# EAGLE board Singularitron 1B (EAGLE 7.7.0)
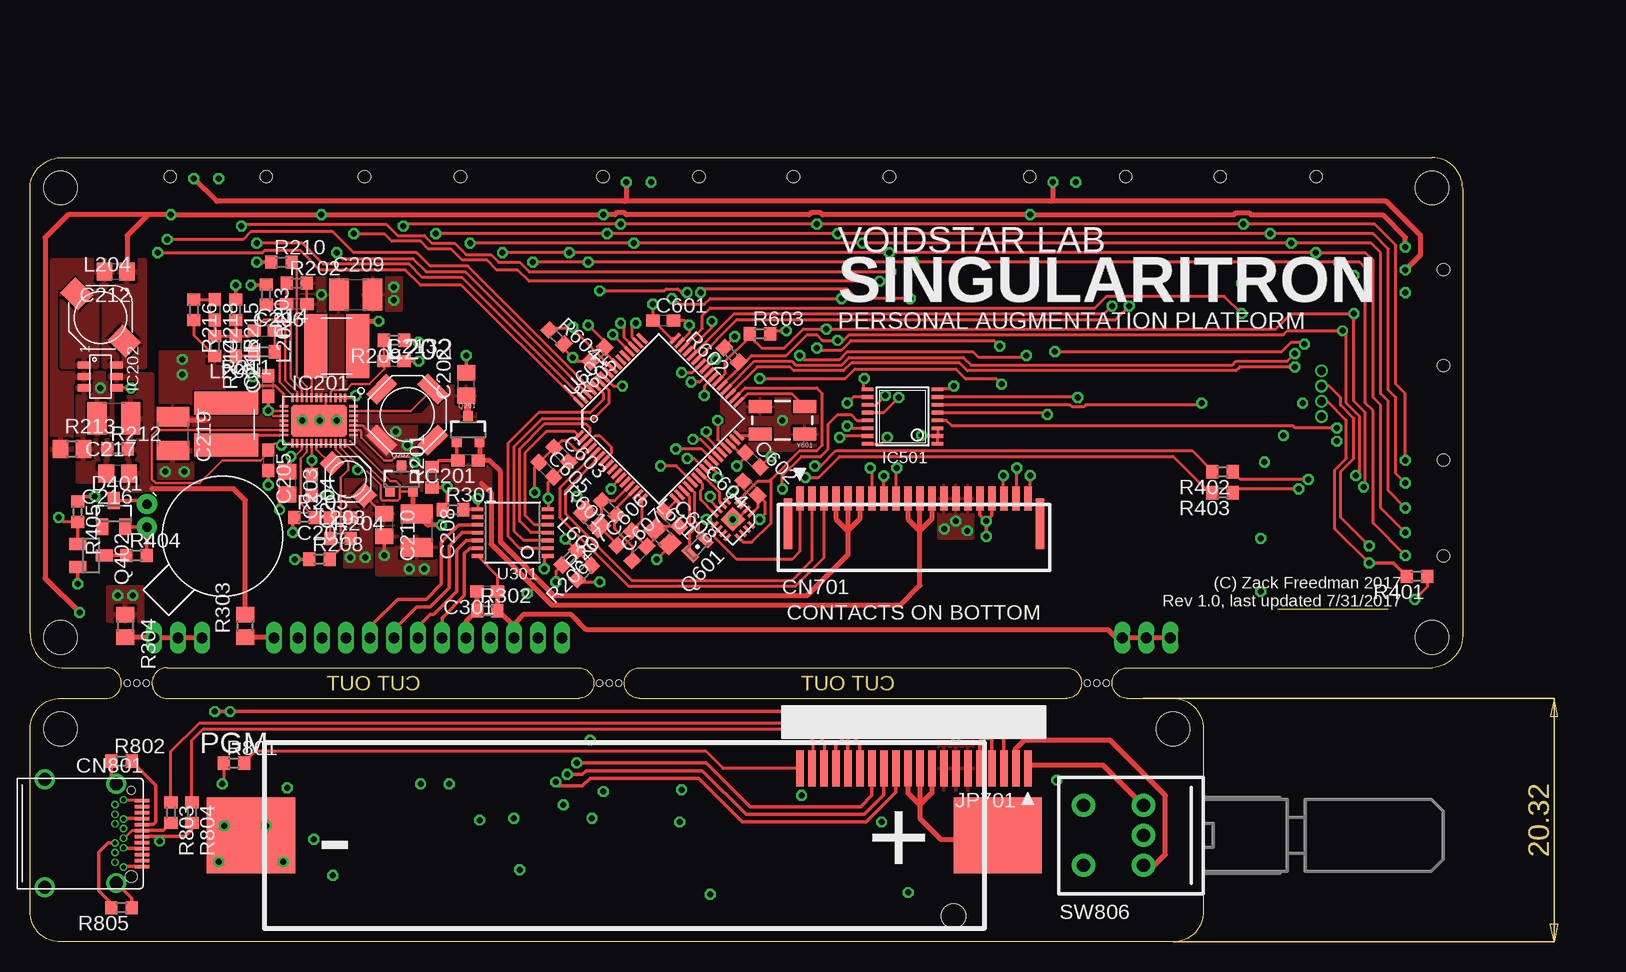
[diagram p8: board, top side]
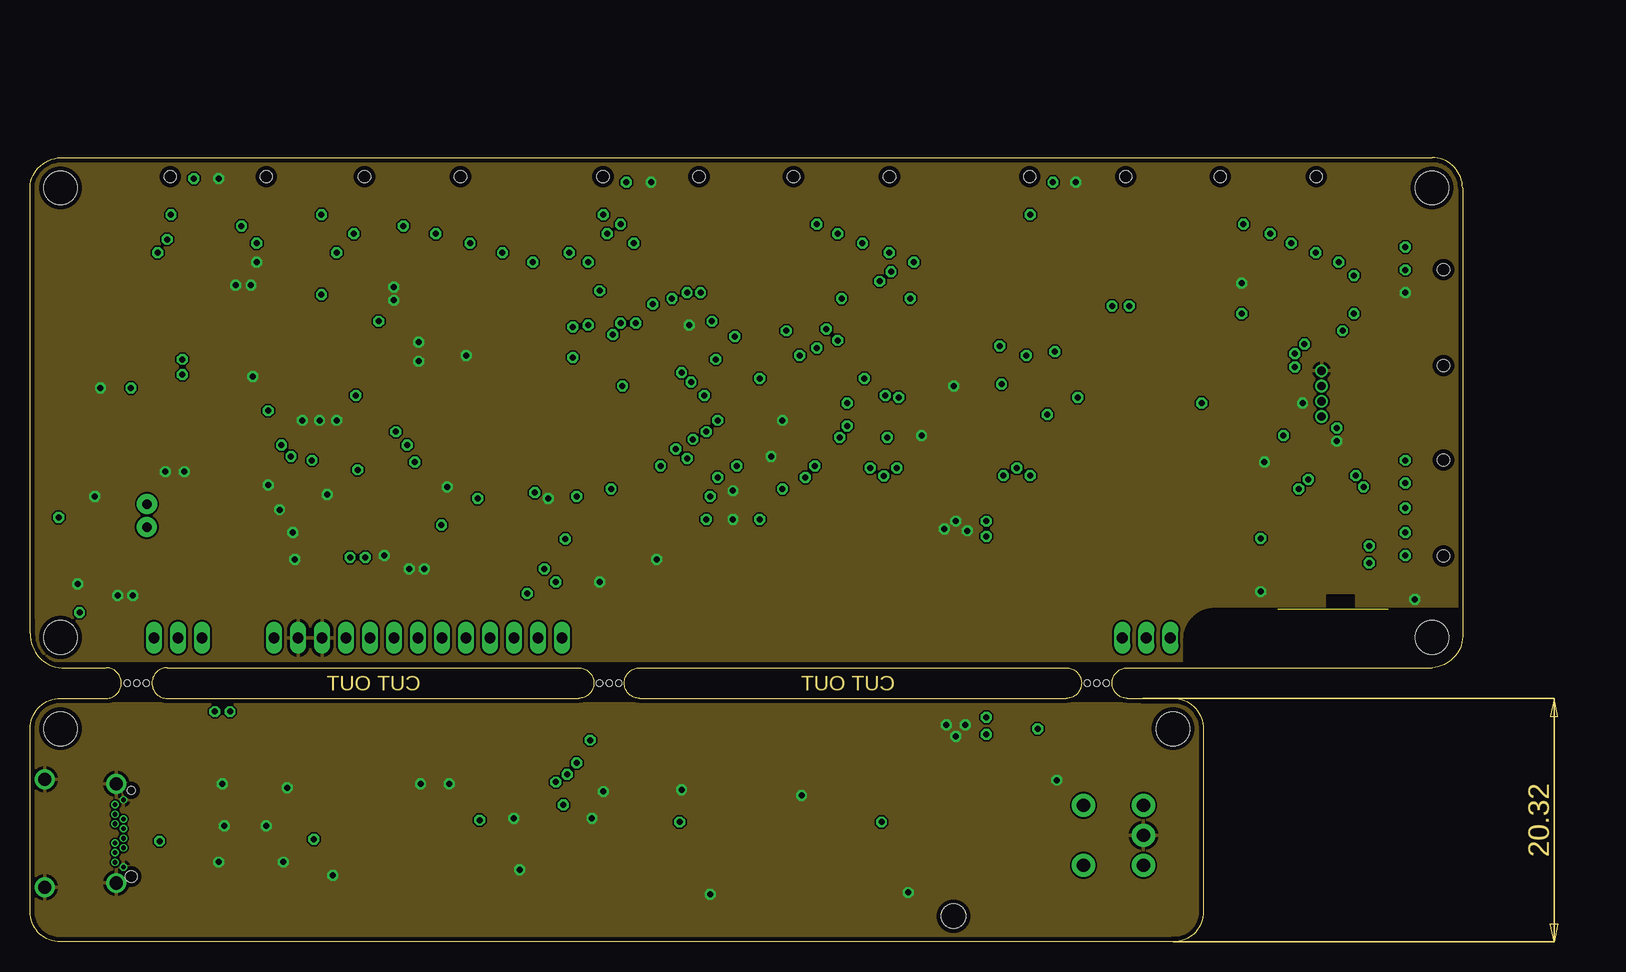
[diagram p9: board, inner layer Route2]
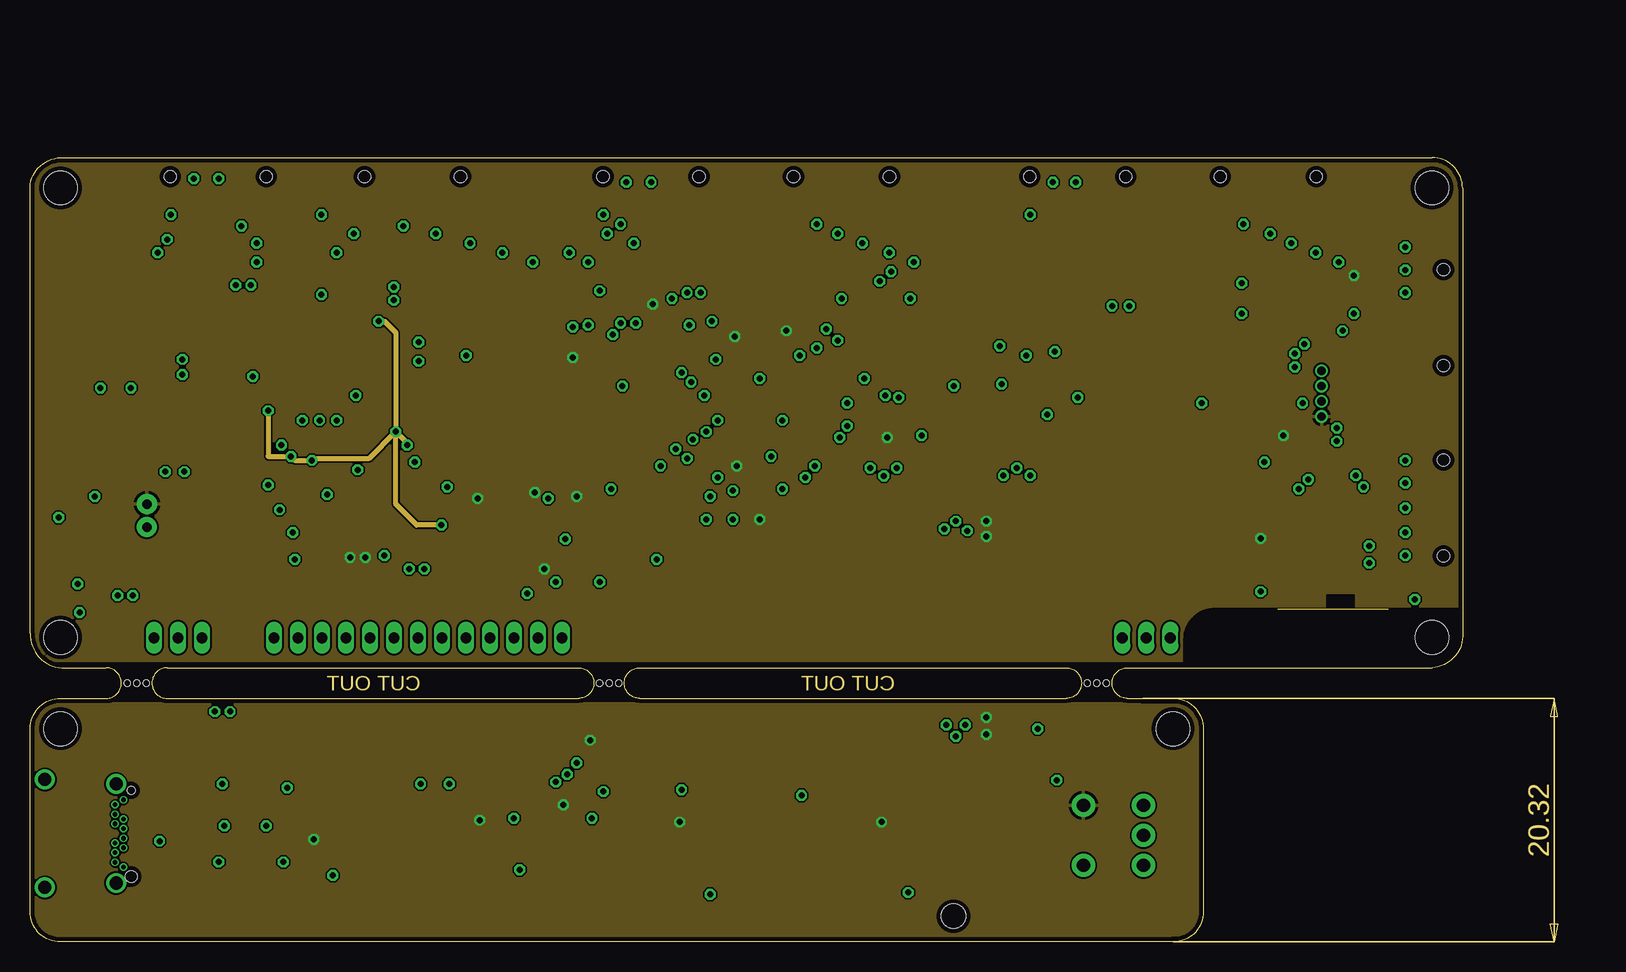
[diagram p10: board, inner layer Route15]
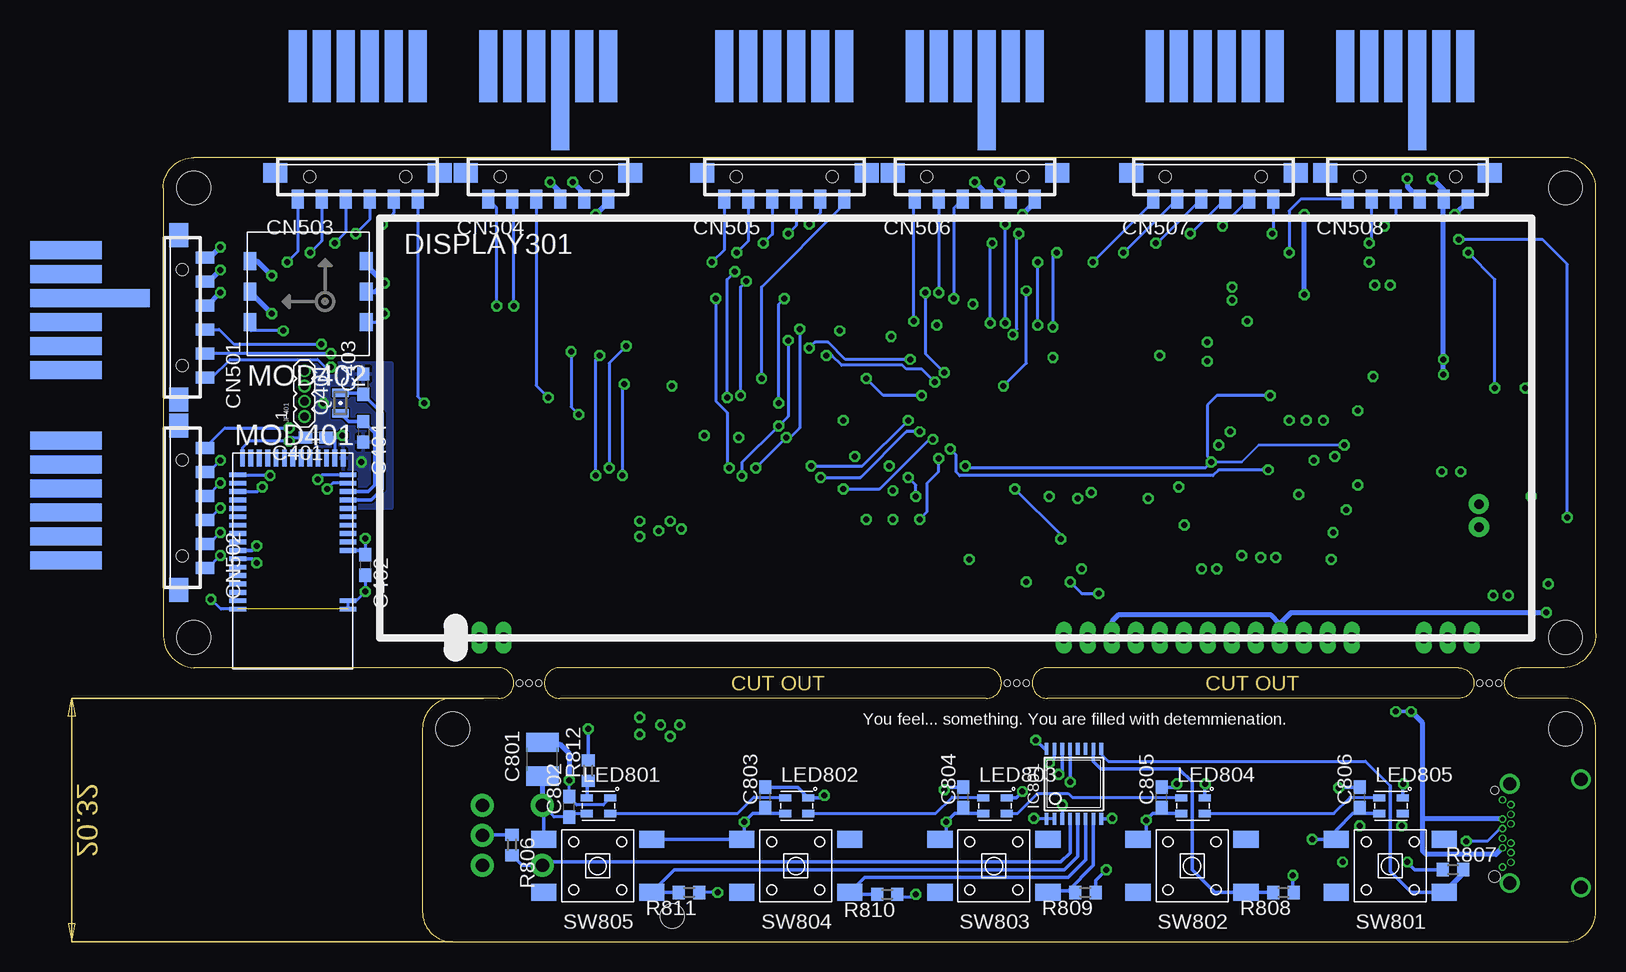
[diagram p11: board, bottom side, seen from below]

Size 119.38 x 65.41 mm. Coordinates in mm from the lower left corner, seen from the top.
Outline: 119.38,62.87 119.38,25.72 arc-90 116.84,22.86 91.44,22.86 arc90 90.17,21.59 arc90 91.44,20.32 95.25,20.32 arc-90 97.79,17.78 97.79,2.54 arc-90 95.25,0 2.54,0 arc-90 0,2.54 0,17.78 arc-90 2.54,20.32 6.35,20.32 arc90 7.62,21.59 arc90 6.35,22.86 3.17,22.86 arc-98 0,25.72 0,63.18 arc-76 2.54,65.41 116.84,65.41 arc-90 119.38,62.87
Outline: 11.43,22.86 45.72,22.86 arc-90 46.99,21.59 arc-90 45.72,20.32 11.43,20.32 arc-90 10.16,21.59 arc-90 11.43,22.86
Outline: 50.8,22.86 86.36,22.86 arc-90 87.63,21.59 arc-90 86.36,20.32 50.8,20.32 arc-90 49.53,21.59 arc-90 50.8,22.86
Copper layers (1*2*15*16): Top 0.035559375mm / dielectric 1.501140625mm / Route2 0.035559375mm / dielectric 0.149859375mm / Route15 0.035559375mm / dielectric 0.200659375mm / Bottom 0.035559375mm
Design rules "typical_4pcb *": minimum track width 7mil, minimum drill 15mil, track to track 6mil, track to pad 6mil, pad to pad 6mil, via to via 6mil, smd to smd 6mil, copper to edge 15mil, drill to drill 8mil, minimum pad ring 4mil, minimum via ring 8mil, stop-mask expansion 2mil, vias tented up to drill 24mil, thermal gap 10mil
Holes 2.8 mm at 116.84,25.4 116.84,62.87 2.54,25.4 2.54,62.87 2.54,17.78 95.25,17.78
Holes 0.5 mm at 89.69,21.59 88.11,21.59 88.9,21.59 8.89,21.59 9.68,21.59 8.1,21.59 48.26,21.59 49.05,21.59 47.47,21.59

## Footprints (pad centres in the part's own frame; a part is rotated, then mirrored left to right if it is on the bottom)
KEYSTONE-1024-PROVISIONAL = smd 7.366 x 6.35: + -31.115,0; - 31.115,0 | hole 2: -27.432,6.731
C0603 = smd 1.1 x 1: 1 -0.85,0; 2 0.85,0
C0805 = smd 1.3 x 1.5: 1 -0.95,0; 2 0.95,0
C1210 = smd 1.6 x 2.7: 1 -1.4,0; 2 1.4,0
9155006 = smd 2 x 1.6: NAIL1 -6.85,0.3; NAIL2 6.85,0.3 | smd 1 x 1.55: PAD1 5,-1.88; PAD2 3,-1.88; PAD3 1,-1.88; PAD4 -1,-1.88; PAD5 -3,-1.88; PAD6 -5,-1.88 | hole 1: -4,0; 4,0
HFW20R-1STE1LF = smd 0.7 x 4.2: NAIL1 -10.5,0.44; NAIL2 10.5,0.44 | smd 0.6 x 2: P$1 -9.5,2.54; P$2 -8.5,2.54; P$3 -7.5,2.54; P$4 -6.5,2.54; P$5 -5.5,2.54; P$6 -4.5,2.54; P$7 -3.5,2.54; P$8 -2.5,2.54; P$9 -1.5,2.54; P$10 -0.5,2.54; P$11 0.5,2.54; P$12 1.5,2.54; P$13 2.5,2.54; P$14 3.5,2.54; P$15 4.5,2.54; P$16 5.5,2.54; P$17 6.5,2.54; P$18 7.5,2.54; P$19 8.5,2.54; P$20 9.5,2.54
12401548E4#2A = smd 0.3 x 1.2: A1 -2.75,4.9; A2 -2.25,4.9; A3 -1.75,4.9; A4 -1.25,4.9; A5 -0.75,4.9; A6 -0.25,4.9; A7 0.25,4.9; A8 0.75,4.9; A9 1.25,4.9; A10 1.75,4.9; A11 2.25,4.9; A12 2.75,4.9 | drill 0.4 pad 0.61: B1 2.8,3.34; B2 2.4,2.64; B3 1.6,2.64; B4 1.2,3.34; B5 0.8,2.64; B6 0.4,3.34; B7 -0.4,3.34; B8 -0.8,2.64; B9 -1.2,3.34; B10 -1.6,2.64; B11 -2.4,2.64; B12 -2.8,3.34 | drill 1.1 pad 1.4: SHIELD1 -4.13,2.74; SHIELD2 4.13,2.74; SHIELD3 -4.5,-3.21; SHIELD4 4.5,-3.21 | hole 0.65: -3.6,3.99 | hole 0.95: 3.6,3.99
SOT23 = smd 1 x 1.4: 1 -0.95,-1.1; 2 0.95,-1.1; 3 0,1.1
DS2045 = drill 0.9 long: 1 -41.682,-17.5; 2 -39.682,-17.5; 3 -37.682,-17.5; 26 9,-17.5; 27 11,-17.5; 28 13,-17.5; 29 15,-17.5; 30 17,-17.5; 31 19,-17.5; 32 21,-17.5; 33 23,-17.5; 34 25,-17.5; 35 27,-17.5; 36 29,-17.5; 37 31,-17.5; 38 33,-17.5; 41 39,-17.5; 42 41,-17.5; 43 43,-17.5
QFN-38_EP_UFE = smd 4.65 x 2.65: EP 0,0 | smd 0.2 x 0.7: P$1 -2.2,-1.9; P$2 -1.8,-1.9; P$3 -1.4,-1.9; P$4 -1,-1.9; P$5 -0.6,-1.9; P$6 -0.2,-1.9; P$7 0.2,-1.9; P$8 0.6,-1.9; P$9 1,-1.9; P$10 1.4,-1.9; P$11 1.8,-1.9; P$12 2.2,-1.9; P$20 2.2,1.9; P$21 1.8,1.9; P$22 1.4,1.9; P$23 1,1.9; P$24 0.6,1.9; P$25 0.2,1.9; P$26 -0.2,1.9; P$27 -0.6,1.9; P$28 -1,1.9; P$29 -1.4,1.9; P$30 -1.8,1.9; P$31 -2.2,1.9 | smd 0.7 x 0.2: P$13 2.9,-1.2; P$14 2.9,-0.8; P$15 2.9,-0.4; P$16 2.9,0; P$17 2.9,0.4; P$18 2.9,0.8; P$19 2.9,1.2; P$32 -2.9,1.2; P$33 -2.9,0.8; P$34 -2.9,0.4; P$35 -2.9,0; P$36 -2.9,-0.4; P$37 -2.9,-0.8; P$38 -2.9,-1.2
SOT-23 = smd 0.6 x 1.05: P1 -0.95,-1.35; P2 0,-1.35; P3 0.95,-1.35; P4 0.95,1.35; P5 0,1.35; P6 -0.95,1.35
TSSOP16 = smd 0.305 x 0.991: 1 -2.275,-2.918; 2 -1.625,-2.918; 3 -0.975,-2.918; 4 -0.325,-2.918; 5 0.325,-2.918; 6 0.975,-2.918; 7 1.625,-2.918; 8 2.275,-2.918; 9 2.275,2.918; 10 1.625,2.918; 11 0.975,2.918; 12 0.325,2.918; 13 -0.325,2.918; 14 -0.975,2.918; 15 -1.625,2.918; 16 -2.275,2.918
QFN16-3X3 = smd 0.7 x 0.25: 1 -1.4,0.75; 2 -1.4,0.25; 3 -1.4,-0.25; 4 -1.4,-0.75; 9 1.4,-0.75; 10 1.4,-0.25; 11 1.4,0.25; 12 1.4,0.75 | smd 0.25 x 0.7: 5 -0.75,-1.4; 6 -0.25,-1.4; 7 0.25,-1.4; 8 0.75,-1.4; 13 0.75,1.4; 14 0.25,1.4; 15 -0.25,1.4; 16 -0.75,1.4 | smd 1.45 x 1.45: PAD 0,0
1X04-1.27MM = drill 0.7 pad 1: 1 0,0; 2 1.27,0; 3 2.54,0; 4 3.81,0
SINGULARITRON_CART_BASE = smd 1.5 x 6 bottom: 3V3 -10.938,7; 5V -12.938,7; DETECT -6.938,7; GPIO1 -4.938,7; GPIO2 -2.938,7; MISO 6.938,7; MOSI 4.938,7; SCK 8.938,7; SCL 12.938,7; SDA 10.938,7; SS 2.938,7 | smd 1.5 x 10 bottom: GND -8.938,5
FFC_1MM_20POS_DIRECT = smd 0.6 x 3: P$1 -9.5,-0.5; P$2 -8.5,-0.5; P$3 -7.5,-0.5; P$4 -6.5,-0.5; P$5 -5.5,-0.5; P$6 -4.5,-0.5; P$7 -3.5,-0.5; P$8 -2.5,-0.5; P$9 -1.5,-0.5; P$10 -0.5,-0.5; P$11 0.5,-0.5; P$12 1.5,-0.5; P$13 2.5,-0.5; P$14 3.5,-0.5; P$15 4.5,-0.5; P$16 5.5,-0.5; P$17 6.5,-0.5; P$18 7.5,-0.5; P$19 8.5,-0.5; P$20 9.5,-0.5
CDRH4D22/HP = smd 5.3 x 1.9: P$1 0,1.75; P$2 0,-1.75
CDRH6D12 = smd 1.25 x 2.4 rotated 225: P$1 -2.139,-2.139 | smd 1.25 x 2.4 rotated 315: P$2 -2.139,2.139 | smd 1.25 x 2.4 rotated 45: P$3 2.139,2.139 | smd 1.25 x 2.4 rotated 135: P$4 2.139,-2.139
CDRH3D16/HP = smd 1.4 x 1.5 rotated 315: P$1 -1.343,1.343; P$2 1.343,-1.343
CDPH4D19F = smd 2.1 x 1.8 rotated 315: P$1 -1.98,1.98; P$2 1.98,-1.98
FB603 = smd 1.3 x 1.5: 1 -0.85,0; 2 0.85,0
SK6805-2427 = smd 1 x 0.6: DIN 0.375,1.85; DOUT 2.325,0.55; GND 2.325,1.85; VCC 0.375,0.55
MDBT40 = smd 1.4 x 0.4: P$1 -4.6,4; P$2 -4.6,3.3; P$3 -4.6,-0.9; P$4 -4.6,-1.6; P$5 -4.6,-2.3; P$6 -4.6,-3; P$7 -4.6,-3.7; P$8 -4.6,-4.4; P$9 -4.6,-5.1; P$10 -4.6,-5.8; P$11 -4.6,-6.5; P$12 -4.6,-7.2; P$26 4.6,-7.2; P$27 4.6,-6.5; P$28 4.6,-5.8; P$29 4.6,-5.1; P$30 4.6,-4.4; P$31 4.6,-3.7; P$32 4.6,-3; P$33 4.6,-2.3; P$34 4.6,-1.6; P$35 4.6,-0.9; P$36 4.6,-0.2; P$37 4.6,0.5; P$38 4.6,1.2; P$39 4.6,1.9; P$40 4.6,2.6; P$41 4.6,3.3; P$42 4.6,4 | smd 0.4 x 1.4: P$13 -4.2,-8.6; P$14 -3.5,-8.6; P$15 -2.8,-8.6; P$16 -2.1,-8.6; P$17 -1.4,-8.6; P$18 -0.7,-8.6; P$19 0,-8.6; P$20 0.7,-8.6; P$21 1.4,-8.6; P$22 2.1,-8.6; P$23 2.8,-8.6; P$24 3.5,-8.6; P$25 4.2,-8.6
EM7180SFP = smd 1.05 x 1.52: P$1 -4.845,2.79; P$2 -4.845,0.25; P$3 -4.845,-2.29; P$4 4.845,-2.29; P$5 4.845,0.25; P$6 4.845,2.79
VIBE-MOTOR-10MM = drill 0.8 pad 1.676: + -5,-3.9; - -6.35,-2.54
SOT23-3 = smd 0.8 x 0.9: 1 -0.95,-1; 2 0.95,-1; 3 0,1.1
FC-12M = smd 0.7 x 1.4: 1 -0.85,0; 2 0.85,0
R0603 = smd 1 x 1.1: 1 -0.85,0; 2 0.85,0
R0805 = smd 1.3 x 1.5: 1 -0.95,0; 2 0.95,0
TL3301-X-FXXX-X-G = smd 2.1 x 1.4: P$1 -4.5,2.2; P$2 4.5,2.2; P$3 -4.5,-2.2; P$4 4.5,-2.2
PEC09-2X20X-TXXXX = drill 1.1 pad 1.93: A -5,-2.5; B -5,2.5; C -5,0; D -10,-2.5; E -10,2.5
TSSOP14 = smd 0.305 x 0.991: 1 -1.95,-2.918; 2 -1.3,-2.918; 3 -0.65,-2.918; 4 0,-2.918; 5 0.65,-2.918; 6 1.3,-2.918; 7 1.95,-2.918; 8 1.95,2.918; 9 1.3,2.918; 10 0.65,2.918; 11 0,2.918; 12 -0.65,2.918; 13 -1.3,2.918; 14 -1.95,2.918
MK20DX128VLH5 = smd 1.1 x 0.285: 1 -5.605,3.385; 2 -5.605,2.885; 3 -5.605,2.385; 4 -5.605,1.885; 5 -5.605,1.385; 6 -5.605,0.885; 7 -5.605,0.385; 8 -5.605,-0.115; 9 -5.605,-0.615; 10 -5.605,-1.115; 11 -5.605,-1.615; 12 -5.605,-2.115; 13 -5.605,-2.615; 14 -5.605,-3.115; 15 -5.605,-3.615; 16 -5.605,-4.115; 33 5.795,-4.115; 34 5.795,-3.615; 35 5.795,-3.115; 36 5.795,-2.615; 37 5.795,-2.115; 38 5.795,-1.615; 39 5.795,-1.115; 40 5.795,-0.615; 41 5.795,-0.115; 42 5.795,0.385; 43 5.795,0.885; 44 5.795,1.385; 45 5.795,1.885; 46 5.795,2.385; 47 5.795,2.885; 48 5.795,3.385 | smd 0.285 x 1.1: 17 -3.655,-6.065; 18 -3.155,-6.065; 19 -2.655,-6.065; 20 -2.155,-6.065; 21 -1.655,-6.065; 22 -1.155,-6.065; 23 -0.655,-6.065; 24 -0.155,-6.065; 25 0.345,-6.065; 26 0.845,-6.065; 27 1.345,-6.065; 28 1.845,-6.065; 29 2.345,-6.065; 30 2.845,-6.065; 31 3.345,-6.065; 32 3.845,-6.065; 49 3.845,5.335; 50 3.345,5.335; 51 2.845,5.335; 52 2.345,5.335; 53 1.845,5.335; 54 1.345,5.335; 55 0.845,5.335; 56 0.345,5.335; 57 -0.155,5.335; 58 -0.655,5.335; 59 -1.155,5.335; 60 -1.655,5.335; 61 -2.155,5.335; 62 -2.655,5.335; 63 -3.155,5.335; 64 -3.655,5.335
CRYSTAL-SMD-5X3 = smd 1.9 x 1.1: 1 -1.85,-1.15; 2 1.85,-1.15; 3 1.85,1.15; 4 -1.85,1.15

## Placement (x,y rotation side)
BAT801  KEYSTONE_1024  [KEYSTONE-1024-PROVISIONAL]  49.53,8.89 180 top
C201  0.1µF  [C0603]  36.51,40.16 180 top
C202  10µF 16V  [C0805]  36.35,46.51 90 top
C203  10µF  [C0805]  21.43,38.26 270 top
C204  1µF  [C0603]  23.5,38.1 270 top
C205  1µF  [C0603]  19.84,40.16 270 top
C206  10pF  [C0603]  22.23,53.18 180 top
C207  10pF  [C0603]  25.88,35.4 180 top
C208  22µF  [C1210]  32.23,34.29 270 top
C209  22µH  [C1210]  27.15,53.97 0 top
C210  10µF  [C0805]  29.53,34.77 270 top
C211  2.2µF  [C0603]  19.84,46.36 90 top
C212  1µF  [C0805]  7.14,55.88 180 top
C213  0.1µF  [C0603]  30.32,48.42 0 top
C214  10pF  [C0603]  19.53,50.96 0 top
C215  330pF  [C0603]  17.14,49.69 270 top
C216  22pF  [C0805]  7.3,39.05 180 top
C217  0.47µH  [C1210]  6.99,43.66 180 top
C218  33pF  [C0603]  15.4,52.7 270 top
C219  22µH  [C1210]  11.91,42.39 270 top
C301  0.01µF  [C0603]  38.1,29.21 180 top
C401  1µF  [C0603]  106.68,42.07 180 bottom
C402  1µF  [C0603]  102.55,31.43 270 bottom
C403  12pF  [C0603]  102.71,46.51 90 bottom
C404  12pF  [C0603]  102.71,42.55 270 bottom
C601  0.1µF  [C0603]  52.77,51.82 0 top
C602  0.1µF  [C0603]  60.23,40.19 315 top
C603  0.1µF  [C0603]  44.29,40.64 315 top
C604  0.1µF  [C0603]  60.03,37.82 135 top
C605  2.2µF  [C0603]  43.02,39.37 315 top
C606  2.2µF  [C0603]  49.53,33.66 45 top
C607  0.1µF  [C0603]  50.8,32.38 45 top
C608  0.1µF  [C0603]  53.5,35.24 315 top
C801  22µH  [C1210]  87.79,15.24 90 bottom
C802  0.1µF  [C0603]  85.57,11.27 90 bottom
C803  0.1µF  [C0603]  69.22,12.06 90 bottom
C804  0.1µF  [C0603]  52.7,12.06 90 bottom
C805  0.1µF  [C0603]  36.2,12.06 90 bottom
C806  0.1µF  [C0603]  19.68,12.06 90 bottom
CN501  AVX_9155066  [9155006]  117.79,52.07 90 bottom
CN502  AVX_9155066  [9155006]  117.79,36.2 90 bottom
CN503  AVX_9155066  [9155006]  103.19,63.82 0 bottom
CN504  AVX_9155066  [9155006]  87.31,63.82 0 bottom
CN505  AVX_9155066  [9155006]  67.63,63.82 0 bottom
CN506  AVX_9155066  [9155006]  51.75,63.82 0 bottom
CN507  AVX_9155066  [9155006]  31.88,63.82 0 bottom
CN508  AVX_9155066  [9155006]  15.68,63.82 0 bottom
CN701  HFW20R-1ST  [HFW20R-1STE1LF]  73.66,34.45 0 top
CN801  12401548E4#2A  [12401548E4#2A]  4.45,9.05 270 top
D401  BAT54C  [SOT23]  6.99,35.72 0 top
DISPLAY301  DS2045  [DS2045]  53.34,42.86 0 bottom
IC201  LTC3586-3  [QFN-38_EP_UFE]  24.07,43.47 180 top
IC202  LT3461A  [SOT-23]  5.87,47.15 270 top
IC501  PCA9534PW  [TSSOP16]  72.71,43.81 90 top
IC601  MKL02Z32VFG4  [QFN16-3X3]  58.58,35.24 225 top
IC801  PCA9534PW  [TSSOP16]  43.5,13.18 0 bottom
JP401  [1X04-1.27MM]  107.63,43.81 90 bottom
JP501  SINGULARITRON_CART_BASE  [SINGULARITRON_CART_BASE]  95.25,66.04 0 top  (outside the outline)
JP502  SINGULARITRON_CART_BASE  [SINGULARITRON_CART_BASE]  59.69,66.04 0 top  (outside the outline)
JP503  SINGULARITRON_CART_BASE  [SINGULARITRON_CART_BASE]  23.81,66.04 0 top  (outside the outline)
JP504  SINGULARITRON_CART_BASE  [SINGULARITRON_CART_BASE]  120.49,44.77 270 top  (outside the outline)
JP701  [FFC_1MM_20POS_DIRECT]  73.66,13.97 180 top
L201  2.2µH  [CDRH4D22/HP]  25.56,49.69 270 top
L202  3.3µH  [CDRH6D12]  31.43,43.97 180 top
L203  4.7µH  [CDRH3D16/HP]  26.51,38.58 0 top
L204  22µH  [CDPH4D19F]  5.87,52.07 180 top
L205  2.2µH  [CDRH4D22/HP]  16.35,43.18 180 top
L601  600Ω@100MHz  [FB603]  52.7,33.81 315 top
L602  600Ω@100MHz  [FB603]  46.83,35.24 135 top
LED801  NEOPIXEL_NANO_2427  [SK6805-2427]  84.45,10.16 0 bottom
LED802  NEOPIXEL_NANO_2427  [SK6805-2427]  67.94,10.16 0 bottom
LED803  NEOPIXEL_NANO_2427  [SK6805-2427]  51.44,10.16 0 bottom
LED804  NEOPIXEL_NANO_2427  [SK6805-2427]  34.92,10.16 0 bottom
LED805  NEOPIXEL_NANO_2427  [SK6805-2427]  18.41,10.16 0 bottom
MOD401  MDBT40  [MDBT40]  108.58,31.75 180 bottom
MOD402  EM7180SFP  [EM7180SFP]  107.31,53.97 0 bottom
MOTOR401  MOTOR10MM  [VIBE-MOTOR-10MM]  16.03,33.81 315 top
Q201  SI2333DS-T1-E3  [SOT23-3]  36.51,42.7 0 top
Q202  SI2333DS-T1-E3  [SOT23-3]  30.96,38.58 0 top
Q401  32kHz 12pF  [FC-12M]  104.62,44.93 90 bottom
Q402  NVR4003NT3G  [SOT23]  5.08,32.23 270 top
Q601  32kHz 12pF  [FC-12M]  55.62,32.95 225 top
R201  40kΩ  [R0603]  33.5,38.73 90 top
R202  88.7kΩ  [R0603]  22.23,54.93 0 top
R203  16.9kΩ  [R0603]  19.68,53.97 270 top
R204  324kΩ  [R0603]  25.88,33.66 0 top
R205  105kΩ  [R0603]  22.86,35.4 0 top
R206  3.61kΩ  [R0603]  44.95,32.04 225 top
R207  10kΩ  [R0603]  46.19,30.81 45 top
R208  1kΩ  [R0603]  24.13,31.91 0 top
R209  3.01kΩ  [R0603]  30.32,50.16 180 top
R210  10kΩ  [R0603]  20.95,56.67 0 top
R211  15kΩ  [R0603]  19.53,49.21 180 top
R212  280kΩ 0.1%  [R0603]  7.3,41.12 0 top
R213  10kΩ 0.1% 250mW  [R0805]  3.49,41.12 0 top
R214  324kΩ  [R0603]  15.4,49.69 270 top
R215  105kΩ  [R0603]  17.14,52.7 270 top
R216  121kΩ  [R0603]  13.65,52.7 270 top
R301  10kΩ  [R0603]  35.24,36.04 0 top
R302  200kΩ  [R0603]  38.1,27.62 0 top
R303  22Ω 1/2W?  [R0805]  17.94,26.35 90 top
R304  6.2Ω 1/2W  [R0805]  7.94,26.35 270 top
R401  12kΩ  [R0603]  115.57,30.48 180 top
R402  220Ω  [R0603]  99.38,39.21 180 top
R403  220Ω  [R0603]  99.38,37.47 180 top
R404  22Ω  [R0603]  8.89,32.23 0 top
R405  10kΩ  [R0603]  3.97,35.88 270 top
R601  470Ω  [R0603]  48.26,36.2 135 top
R602  4.7kΩ  [R0603]  58.46,48.96 135 top
R603  4.7kΩ  [R0603]  60.85,50.71 0 top
R604  4.7kΩ  [R0603]  43.88,50.44 315 top
R605  4.7kΩ  [R0603]  47.29,49.01 225 top
R801  1MΩ  [R0603]  16.99,14.92 0 top
R802  5.1kΩ  [R0603]  7.62,15.08 0 top
R803  33Ω  [R0603]  11.75,10.79 270 top
R804  33Ω  [R0603]  13.49,10.79 270 top
R805  5.1kΩ  [R0603]  7.62,2.86 180 top
R806  10kΩ  [R0603]  90.33,8.1 270 bottom
R807  10kΩ  [R0603]  11.91,6.03 0 bottom
R808  10kΩ  [R0603]  26.04,4.13 180 bottom
R809  10kΩ  [R0603]  42.55,4.13 180 bottom
R810  10kΩ  [R0603]  59.05,3.97 180 bottom
R811  10kΩ  [R0603]  75.56,4.13 180 bottom
R812  100Ω  [R0603]  83.98,14.29 90 bottom
SW801  TACTILE_SWITCHTL3301-G  [TL3301-X-FXXX-X-G]  17.14,6.35 180 bottom
SW802  TACTILE_SWITCHTL3301-G  [TL3301-X-FXXX-X-G]  33.66,6.35 180 bottom
SW803  TACTILE_SWITCHTL3301-G  [TL3301-X-FXXX-X-G]  50.16,6.35 180 bottom
SW804  TACTILE_SWITCHTL3301-G  [TL3301-X-FXXX-X-G]  66.67,6.35 180 bottom
SW805  TACTILE_SWITCHTL3301-G  [TL3301-X-FXXX-X-G]  83.19,6.35 180 bottom
SW806  PEC09  [PEC09-2X20X-TXXXX]  97.79,8.89 0 top
U301  [TSSOP14]  40.21,34.13 90 top
U601  MK20DX128VLH5  [MK20DX128VLH5]  52.07,43.81 45 top
Y601  16MHz like ECX-53B  [CRYSTAL-SMD-5X3]  62.71,43.5 180 top

## Tracks (layer width: path | path; a pad name or v marks a point on that pad's centre or on a via)
3V3_LDO  (via drill 0.5)
  Top 0.203: IC201.P$20 21.11,41.57 20.4,41.57 C205.1 | IC201.P$33 27.5,42.67 27.62,42.55 27.62,42.07 29.53,40.16 30.16,40.16 30.48,40.48 31.59,40.48 v32.07,40 | v27.15,45.56 26.95,45.37 IC201.P$1 IC201.P$2 IC201.P$3 | IC201.P$18 10.6,42.67 10.16,42.23 10.16,38.58 10.48,38.26 14.13,38.26 16.03,40.16 19.21,40.16 19.84,40.8 C205.1 | C205.1 19.84,41.12
  Top 0.254: v20.95,41.43 20.98,41.43 21.11,41.57 | U601.21 53.86,39.69 v52.55,39.69
  Bottom 0.203: v20.95,41.43 28.1,41.43 29.53,40 v32.07,40
  Bottom 0.254: v52.55,39.69 52.39,39.53 32.54,39.53 v32.07,40 32.07,40.16 32.38,40.48 32.38,44.77 31.59,45.56 v27.15,45.56
+3V3  (via drill 0.5)
  Top 0.254: R216.2 13.65,50.59 R214.2
  Top 0.406: v114.62,56.04 115.89,57.31 115.89,58.9 113.03,61.75 85.09,61.75 | 85.09,61.75 49.53,61.75 | 49.53,61.75 15.56,61.75 v13.65,63.66 | v49.69,63.34 49.69,61.91 49.53,61.75 | v85.25,63.34 85.25,61.91 85.09,61.75 | 14.61,43.5 11.75,43.5
  Bottom 0.406: CN501.PAD2 115.59,55.07 v114.62,56.04 | v13.65,63.66 12.68,62.69 CN508.PAD2 12.7,61.95 | CN506.PAD2 49.69,62.87 v49.69,63.34 | CN504.PAD2 84.31,62.41 v85.25,63.34 | v12.7,47.31 v12.7,48.58 12.7,61.95 | 12.7,62.23 12.7,61.95
  pour Top: 21.11,42.23 10.79,42.23 10.79,49.21 16.19,49.21 16.19,43.97 21.11,43.97
+5V  (via drill 0.5)
  Top 0.203: R202.2 C206.1
  Top 0.254: U301.14 38.95,30.53 C301.1
  Top 0.406: C301.1 R302.2 39.07,27.62 40.34,26.35 | v114.62,57.94 114.62,58.74 112.71,60.64 101.76,60.64 101.6,60.8 100.49,60.8 100.33,60.64 v83.34,60.64 66.04,60.64 65.88,60.8 65.09,60.8 64.93,60.64 49.69,60.64 49.53,60.8 48.9,60.8 48.74,60.64 v47.78,60.64 v24.29,60.64 v11.75,60.64 9.84,60.64 | 9.84,60.64 8.1,58.9 C212.1 | 9.84,60.64 3.17,60.64 1.27,58.74 1.27,30.32 v4.13,27.46 | DISPLAY301.1 DISPLAY301.2 DISPLAY301.3 90.53,25.36 89.85,26.04 46.35,26.04 45.09,27.3 41.12,27.3 40.34,26.53 40.34,26.35 | 40.34,26.35 DISPLAY301.28
  Bottom 0.406: CN501.PAD1 115.49,57.07 v114.62,57.94 | CN504.PAD1 82.31,61.67 v83.34,60.64 | v47.78,60.64 46.75,61.67 CN506.PAD1 | CN508.PAD1 10.68,61.71 v11.75,60.64 | v24.29,53.97 v24.29,60.64 | DISPLAY301.35 26.34,26.52 | 26.34,26.52 25.4,27.46 v4.13,27.46 | 26.34,26.52 27.07,27.25 39.8,27.25 40.34,26.71 DISPLAY301.28
  pour Top: 7.46,56.83 9.53,56.83 9.53,47.94 6.19,47.94 6.19,53.66 7.46,54.93
  pour Top: 22.54,45.4 22.54,55.4 26.35,55.4 26.35,45.4
AGND
  Top 0.203: 52.1,33.69 L601.1
  Top 0.254: C608.2 52.33,34.64 L601.1 | 52.1,33.69 C607.2 C606.2 51.02,35.14 U601.16 U601.15
BAT+  (via drill 0.5)
  Top 0.254: R206.2 43.81,30.9 v43.81,30 | v41.43,29.05 41.83,29.45 42.15,29.45
  Top 0.406: 37.62,38.26 38.42,37.47 38.42,33.18 42.15,29.45 43.5,28.1 72.55,28.1 74.16,29.71 74.16,34.29 | 74.16,34.29 CN701.P$11 | CN701.P$10 73.16,35.29 74.16,34.29 | CN701.P$12 75.16,35.29 74.16,34.29
  Bottom 0.254: v43.81,30 42.86,29.05 v41.43,29.05
  pour Top: 26.67,42.7 26.67,41.27 30.16,37.62 38.42,37.62 38.42,39.85 30.32,39.85 27.46,42.7
BAT+'
  Top 0.406: JP701.P$10 74.16,11.43 | 74.16,11.43 74.16,10.29 75.88,8.57 80.33,8.57 BAT801.+ | JP701.P$9 75.16,12.43 74.16,11.43 | JP701.P$11 73.16,12.43 74.16,11.43
BATTERY_MONITOR  (via drill 0.5)
  Top 0.254: R207.2 R206.1 v44.61,33.59 | v48.42,37.78 48.42,37.88 U601.11
  Bottom 0.254: v48.42,37.78 44.61,33.97 v44.61,33.59
CHARGE_STATUS  (via drill 0.5)
  Top 0.203: v27.3,39.37 27.3,39.75 25.88,41.18 25.88,41.56 IC201.P$30
  Top 0.254: U601.26 55.96,41.12 v53.82,41.12
  Bottom 0.254: v27.3,39.37 31.43,39.37 31.91,38.89 53.02,38.89 53.34,39.21 53.34,40.64 v53.82,41.12
CLPROG
  Top 0.203: R209.2 C213.1 29.53,48.36 29.53,47.78 28.26,46.51 26.83,46.51 26.35,46.04 25.24,46.04 25.07,45.86 IC201.P$4
DETECT_MOD0  (via drill 0.5)
  Top 0.254: v85.41,49.21 104.3,49.21 105.09,50.01 106.05,50.01 v106.2,49.85 | IC501.5 84.61,44.14 v84.77,43.97
  Bottom 0.254: CN501.PAD4 114.73,51.07 113.51,49.85 v106.2,49.85 | v85.41,49.21 85.41,44.61 v84.77,43.97
DETECT_MOD1  (via drill 0.5)
  Top 0.254: v87.31,45.4 87.28,45.44 IC501.7
  Bottom 0.254: CN504.PAD4 88.31,46.4 v87.31,45.4
DETECT_MOD2  (via drill 0.5)
  Top 0.254: v53.5,53.66 53.66,53.66 54.13,53.18 56.2,53.18 56.67,53.66 v67.63,53.66 | IC501.10 68.62,45.44 v68.1,44.93
  Bottom 0.254: CN506.PAD4 53.5,61.19 v53.5,53.66 | v68.1,44.93 68.1,53.18 v67.63,53.66
DETECT_MOD3  (via drill 0.5)
  Top 0.254: v17.62,59.69 17.78,59.85 29.69,59.85 30.64,58.9 32.86,58.9 33.5,58.26 35.4,58.26 36.35,57.31 38.42,57.31 39.05,56.67 40.8,56.67 41.59,55.88 v71.75,55.88 | IC501.12 71.13,44.14 v72.39,45.4
  Bottom 0.254: CN508.PAD4 16.68,60.63 v17.62,59.69 | v72.39,45.4 72.39,55.24 v71.75,55.88
DISPLAY_RESET
  Top 0.254: U301.2 40.83,32.83 39.85,33.81 39.85,41.59 42.39,44.13 46.67,44.13 47.78,45.24 47.78,45.76 U601.60
DISPLAY_SCK
  Top 0.254: 45.7,42.23 U601.1 45.41,42.55 43.02,42.55 41.27,40.8 41.27,35.56 42.05,34.78 U301.5
DISPLAY_SUPPLY_EN  (via drill 0.5)
  Top 0.254: v8.41,46.2 IC202.P4 | v10.64,57.47 19.37,57.47 19.53,57.63 22.54,57.63 24.13,56.04 31.27,56.04 32.54,54.77 35.95,54.77 U601.64
  Bottom 0.254: v8.41,46.2 8.41,55.24 v10.64,57.47
ENCODER_A  (via drill 0.5)
  Top 0.254: U601.41 56.99,48.58 v57.15,48.58 | v65.56,49.53 65.72,49.37 67.63,49.37 68.42,50.16 80.33,50.16 v80.8,49.69 | CN701.P$19 82.23,37.06 v82.23,39.53
  Bottom 0.254: v57.15,48.58 62.55,48.58 63.98,50.01 65.09,50.01 v65.56,49.53 | v80.8,49.69 82.23,48.26 v82.23,39.53
ENCODER_A'
  Top 0.406: SW806.A 93.7,6.39 94.61,7.3 94.61,12.22 90.01,16.83 82.87,16.83 82.07,16.03 82.07,14.56 JP701.P$2
ENCODER_B  (via drill 0.5)
  Top 0.254: U601.40 55.8,46.67 v55.09,46.67 | v64.14,48.89 64.45,48.58 67.47,48.58 68.1,49.21 78.58,49.21 79.06,48.74 82.71,48.74 82.87,48.89 v83.03,48.89 | CN701.P$20 83.34,37.17 v83.34,38.89
  Bottom 0.254: v55.09,46.67 56.2,47.78 57.47,47.78 57.78,48.1 62.87,48.1 63.66,48.89 v64.14,48.89 | v83.34,38.89 83.34,48.58 v83.03,48.89
ENCODER_B'
  Top 0.406: JP701.P$1 83.16,14.74 83.19,14.76 89.42,14.76 SW806.B
GND  (via drill 0.5)  (1 unrouted)
  Top 0.203: IC201.P$5 24.67,44.07 | 24.67,44.07 IC201.EP 24.1,43.47 v24.13,43.5 v22.7,43.5 | v25.56,43.5 25.23,43.5 24.67,44.07
  Top 0.254: IC601.2 58.93,35.24 IC601.PAD | v58.58,37.62 59.38,38.42 C604.2 59.66,38.42 | C602.2 61.72,40.48 v61.75,40.48 | R301.1 34.77,36.41 v34.77,37.94 | U601.4 45.91,40.32 45.18,40.32 C603.2 C605.2 43.18,38.33 v43.18,36.99 43.18,36.13 U301.7 | L601.2 53.31,32.99 v52.23,31.91 | U601.47 54.93,50.75 v54.93,51.44 54.54,51.82 C601.2 | IC501.1 IC501.2 | IC501.3 IC501.2 | v76.99,46.36 76.73,46.09 IC501.8 | v74.3,42.23 75.66,42.23 IC501.2 | R207.1 45.79,30 v47.47,30 | 19.74,47.15 19.8,47.2 C211.2 | 20.8,36.83 21.27,37.31 C203.2 | R401.1 116.42,29.58 v115.41,28.57
  Top 0.305: 19.74,47.15 v18.57,47.15 | R215.1 v17.14,54.77 | R203.1 19.63,54.77 v18.41,54.77 | R210.1 v18.89,56.67 | C205.2 v19.84,38.1 | v21.91,34.13 21.91,35.3 R205.1 | v20.8,36.04 20.8,36.83 | R208.1 v22.07,31.91 | C204.2 24.71,37.25 v24.77,37.31 | C210.2 v29.53,32.23 | R201.1 34.71,37.88 v34.77,37.94 | C202.2 v36.35,48.89 | C213.2 v32.38,48.42 | R209.1 32.23,50.16 v32.38,50.01 | Q402.2 3.97,31.27 v3.97,29.84 | R405.1 4.39,37.15 v5.4,37.15
  Bottom 0.254: C401.2 108.58,42.07 v108.9,41.75 112.24,41.75 112.78,41.2 MOD401.P$25 | MOD401.P$1 MOD401.P$2 103.31,28.45 v102.55,29.21 C402.2 | MOD401.P$42 114.59,27.75 v115.41,28.57
  Bottom 0.406: CN501.PAD3 115.68,53.07 v114.62,54.13 | v15.72,63.66 15.72,62.97 CN508.PAD3 | CN506.PAD3 50.75,62.34 v51.75,63.34 | CN504.PAD3 86.31,62.5 v87.15,63.34 | MOD402.P$5 101.67,54.22 v100.97,54.93 102.47,56.43 MOD402.P$6
  other vias: 30.32,54.61 30.32,53.5 32.86,31.12 31.59,31.12 5.87,46.2 7.3,28.89 8.57,28.89 11.27,39.21 12.86,39.21 58.58,35.24 62.71,43.5 76.2,34.45 77.15,35.08 78.11,34.29 106.05,44.93 102.87,40
  pour Route2: 119.06,66.36 -0.64,66.04 0.64,23.5 120.65,23.5
  pour Top: 33.81,30.64 33.81,33.81 28.89,33.81 28.89,30.64
  pour Top: 27.78,52.7 27.78,55.4 30.96,55.4 30.96,52.7
  pour Top (rank 2): 6.83,56.83 6.83,40.64 1.91,40.64 1.91,56.83
  pour Top (rank 2): 6.51,29.53 6.51,26.83 9.37,26.83 9.37,29.53
  pour Top (rank 2): 13.49,41.27 13.49,38.58 10.79,38.58 10.79,41.27
  pour Top: 66.04,46.36 66.04,40.96 57.63,40.96 57.63,46.36
  pour Top: 75.72,38.1 78.58,38.1 78.58,33.66 75.72,33.66
  pour Bottom: 106.68,48.26 100.33,48.26 100.33,36.2 106.68,36.2
GND'  (via drill 0.5)
  Top 0.254: CN801.A1 7.83,11.8 CN801.B12 | R801.1 16.14,13.28 v16.03,13.18
  Top 0.305: CN801.A12 7.83,6.3 CN801.B1 | R805.1 8.47,3.63 CN801.SHIELD2 | v19.68,9.68 18.89,8.89 BAT801.- | R802.1 6.77,13.59 CN801.SHIELD1
  Bottom 0.254: IC801.2 IC801.1 46.77,10.26 v46.83,10.32 | LED801.GND 82.71,11.43 84.93,11.43 85.57,12.06 C802.2 v85.57,13.49 | 58.2,3.75 56.89,3.75 v56.67,3.97 | v73.18,4.13 R811.1
  Bottom 0.305: R808.1 25.24,4.18 v25.24,5.56 | R809.1 41.7,5.14 v40.8,6.03 | R810.1 58.2,3.75 | R806.1 92.73,8.95 SW806.C | C806.2 21.38,12.91 v21.43,12.86 | LED805.GND 16.09,13.12 v16.03,13.18 | LED804.GND 32.6,13.12 v32.54,13.18 | C805.2 35.19,12.91 v34.92,13.18 | IC801.8 40.38,10.26 v40.32,10.32 | LED803.GND 48.31,12.01 v47.78,12.54 | C804.2 54.08,12.91 v54.29,12.7 | R807.1 15.08,6.03 v15.72,6.67 | C803.2 66.53,12.91 LED802.GND 64.51,12.01 v64.29,12.22
  Bottom 0.406: C801.2 87.66,16.51 86.36,16.51 85.57,15.72 v85.57,13.49
  other vias: 21.11,6.67 16.19,9.68 77.15,17.14 76.36,18.1 77.95,18.1
  pour Route2: -1.27,19.84 99.06,19.84 99.06,-1.27 -1.27,-1.27
  pour Top: 78.58,12.7 75.72,12.7 75.72,18.89 78.58,18.89
GPIO1_MOD0  (via drill 0.5)
  Top 0.254: U601.36 60.37,48.42 63.5,48.42 63.82,48.1 67.63,48.1 68.26,48.74 77.79,48.74 78.42,48.1 100.17,48.1 100.49,48.42 104.78,48.42 v105.41,49.05
  Bottom 0.254: v105.41,49.05 105.43,49.07 CN501.PAD5
GPIO1_MOD1  (via drill 0.5)
  Top 0.254: U601.44 58.68,52.39 89.53,52.39 v90.17,53.02
  Bottom 0.254: v90.17,53.02 90.17,61.8 CN504.PAD5
GPIO1_MOD2  (via drill 0.5)
  Top 0.254: U601.58 48.6,46.36 v49.37,46.36 | v47.47,54.29 52.86,54.29 53.02,54.45 53.98,54.45 54.29,54.13 v54.75,54.13
  Bottom 0.254: CN506.PAD5 v54.75,54.13 | v49.37,46.36 47.47,48.26 v47.47,54.29
GPIO1_MOD3  (via drill 0.5)
  Top 0.254: U601.63 36.02,55.4 32.7,55.4 31.59,56.52 24.45,56.52 22.7,58.26 v18.89,58.26
  Bottom 0.254: v18.89,58.26 18.68,58.47 CN508.PAD5
GPIO2_MOD0  (via drill 0.5)
  Top 0.254: v105.41,47.94 100.81,47.94 100.49,47.62 78.11,47.62 77.47,48.26 68.42,48.26 67.79,47.62 63.66,47.62 63.34,47.94 60.6,47.94 U601.35
  Bottom 0.254: CN501.PAD6 115.33,47.07 113.82,48.58 106.52,48.58 105.89,47.94 v105.41,47.94
GPIO2_MOD1  (via drill 0.5)
  Top 0.254: U601.43 58.91,51.91 90.49,51.91 v91.6,53.02
  Bottom 0.254: v91.6,53.02 91.6,61.22 CN504.PAD6
GPIO2_MOD2  (via drill 0.5)
  Top 0.254: U601.45 56.83,51.24 v56.83,51.75
  Bottom 0.254: v56.83,51.75 56.83,61.86 CN506.PAD6
GPIO2_MOD3  (via drill 0.5)
  Top 0.254: U601.62 36.25,55.88 33.02,55.88 31.91,56.99 26.04,56.99 v25.56,57.47
  Bottom 0.254: CN508.PAD6 24.58,61.94 25.56,60.96 v25.56,57.47
INT_BLE  (via drill 0.5)
  Top 0.254: v57.31,43.5 57.31,41.89 U601.29 | v65.41,39.69 65.88,39.69 67.15,40.96 96.84,40.96 98.53,39.27 R402.2
  Bottom 0.254: v65.41,39.69 61.12,39.69 v57.31,43.5
INT_BUTTON  (via drill 0.5)
  Top 0.203: 72.16,39.44 72.16,39.46 v72.23,39.53
  Top 0.254: v54.29,47.47 55.18,47.47 U601.42 | v73.34,53.66 68.9,53.66 68.1,54.45 56.2,54.45 v55.88,54.13 | 72.16,39.44 CN701.P$9
  Bottom 0.254: v55.88,54.13 55.88,49.05 v54.29,47.47 | v73.34,53.66 73.34,45.09 72.39,44.13 72.39,39.69 v72.23,39.53
INT_BUTTON'  (via drill 0.5)
  Top 0.305: JP701.P$12 72.16,12.47 69.69,10 59.37,10 55.72,13.65 46.67,13.65 46.04,13.02 44.13,13.02 v43.81,13.33
  Bottom 0.203: 43.82,13.66 43.82,13.34 v43.81,13.33
  Bottom 0.305: 43.82,13.66 IC801.13
INT_HOTPLUG  (via drill 0.5)
  Top 0.254: U601.27 55.88,41.91 v55.24,41.91 | v62.71,37.78 62.71,38.89 64.29,40.48 65.88,40.48 66.52,41.12 66.52,43.18 67.31,43.97 68.42,43.97 68.9,43.5 IC501.13
  Bottom 0.254: v62.71,37.78 59.69,37.78 55.56,41.91 v55.24,41.91
INT_SENTRAL  (via drill 0.5)
  Top 0.254: U601.46 56.04,51.16 56.04,52.23 56.67,52.86 88.74,52.86 89.69,53.82 99.54,53.82 v100.97,52.39
  Bottom 0.254: 102.3,51.05 MOD402.P$4 101.67,51.69 v100.97,52.39
LEDS  (via drill 0.5)
  Top 0.254: U601.39 56.2,46.37 v56.2,45.56 | v60.8,46.99 67.94,46.99 68.74,47.78 77.15,47.78 77.95,46.99 80.49,46.99 v80.96,46.51 | CN701.P$18 81.12,37.03 v81.12,38.89
  Bottom 0.254: v56.2,45.56 59.37,45.56 v60.8,46.99 | v80.96,46.51 81.12,46.36 v81.12,38.89
LEDS'  (via drill 0.5)
  Top 0.305: JP701.P$3 81.16,17.34 82.23,18.41 83.34,18.41 v83.98,17.78
  Bottom 0.305: v83.98,17.78 R812.2
MISO  (via drill 0.5)
  Top 0.254: v114.62,38.26 113.82,39.05 113.82,45.4 113.19,46.04 113.19,57.78 111.92,59.05 v103.35,59.05 v67.31,59.05 v48.1,59.05 v33.81,59.05 | U601.52 49.96,49.26 v48.58,50.64
  Bottom 0.254: CN502.PAD3 115.68,37.2 v114.62,38.26 | CN505.PAD3 66.63,59.74 v67.31,59.05 | CN503.PAD3 102.19,60.21 v103.35,59.05 | CN507.PAD3 33.76,59.05 v33.81,59.05 | v48.58,50.64 48.58,50.8 48.26,51.12 48.26,58.9 v48.1,59.05
MOSI  (via drill 0.5)
  Top 0.254: v114.62,40.16 114.62,45.72 113.82,46.51 113.82,58.1 112.08,59.85 v101.12,59.85 v65.56,59.85 v49.21,59.85 31.27,59.85 v31.11,59.69 | U601.51 49.53,50.38 49.53,51.28 v49.21,51.59
  Bottom 0.203: 30.97,59.85 30.97,59.84 v31.11,59.69
  Bottom 0.254: CN502.PAD2 115.59,39.2 v114.62,40.16 | CN505.PAD2 64.63,60.78 v65.56,59.85 | CN503.PAD2 100.19,60.78 v101.12,59.85 | 30.97,59.85 CN507.PAD2 | v49.21,51.59 v49.21,59.85
N$1
  Top 0.406: C202.1 36.35,43.81 | 36.51,45.4 36.51,43.66
  pour Top: 27.15,43.34 27.15,43.97 32.54,43.97 34.92,46.36 37.15,46.36 37.15,43.34
N$2
  Top 0.203: L202.P$1 31.72,44.27 IC201.P$37
N$3  (via drill 0.5)
  Top 0.254: IC601.7 56.67,36.79 v56.67,37.15 | v57.31,38.73 57.31,39.06 U601.25
  Bottom 0.254: v56.67,37.15 56.67,38.1 v57.31,38.73
N$4
  Top 0.305: R201.2 34.08,40.16 C201.2 35.56,40.26 Q201.1
N$5
  Top 0.305: DISPLAY301.31 34.34,27.04 36.2,28.89 36.2,32.38 36.64,32.83 U301.13
N$6
  Top 0.203: IC201.P$31 30.01,37.83 Q202.1
N$7
  Top 0.406: DISPLAY301.38 20.3,25.4 R303.1
N$8
  Top 0.406: DISPLAY301.41 DISPLAY301.42 DISPLAY301.43 10.3,25.4 R304.2
N$9
  Top 0.305: DISPLAY301.32 32.54,25.57 32.54,26.51 33.34,27.3 33.66,27.3 35.56,29.21 35.56,32.7 36.34,33.48 U301.12
N$10
  Top 0.305: DISPLAY301.33 30.64,25.66 30.64,26.35 32.23,27.94 33.34,27.94 34.92,29.53 34.92,33.02 36.04,34.13 U301.11
N$11
  Top 0.305: DISPLAY301.34 28.57,25.6 28.57,26.51 30.64,28.57 33.02,28.57 34.29,29.84 34.29,33.34 35.73,34.78 U301.10
N$12
  Top 0.254: U601.22 56.04,38.21 56.04,37.78 55.88,37.62 55.88,36.88 IC601.8
N$13
  Top 0.406: C301.2 R302.1 36.34,26.71 DISPLAY301.30
N$14  (via drill 0.5)
  Top 0.254: IC601.9 56.6,35.24 v56.36,35.24 | v54.77,40.32 55.34,40.32 U601.24
  Bottom 0.254: v54.77,40.32 54.77,39.21 55.72,38.26 55.72,35.88 v56.36,35.24
N$15
  Top 0.254: CN801.B6 7.86,8.65 8.51,9.3 CN801.A6
  Top 0.305: CN801.A6 11.1,9.3 R803.2
N$16  (via drill 0.5)
  Top 0.254: v106.52,38.58 100.86,38.58 R402.1
  Bottom 0.254: MOD401.P$12 106.15,38.95 v106.52,38.58
N$17
  Top 0.203: IC201.P$25 23.87,41.06 25.01,39.92 L203.P$1
N$18
  Top 0.254: U601.32 60.75,42.25 Y601.3
N$19
  Top 0.254: U601.33 59.79,45.72 63.48,45.72 Y601.1
N$20
  Top 0.254: U601.19 54.93,37.2 54.93,34.92 55.24,34.61 55.24,34.29 54.93,33.97 54.93,32.44 Q601.2
N$21
  Top 0.254: U601.20 55.37,37.47 55.4,37.47 55.4,35.08 55.72,34.77 55.72,34.05 Q601.1
N$22
  Top 0.203: IC201.P$29 25.47,41.05 26.51,40 26.51,39.37 25.88,38.73 25.88,32.8 R208.2
N$23
  Top 0.203: 53.77,36.72 | 53.77,36.72 U601.17
  Top 0.254: 53.77,36.72 C608.1
N$24
  Top 0.203: IC201.P$23 23.07,40.85 22.54,40.32 22.54,36.57 R205.2 C207.2 R204.1
N$25
  Top 0.305: D401.2 9.71,34.62 MOTOR401.+ R404.2
N$26
  Top 0.203: 48.86,36.2 R601.1
  Top 0.254: U601.14 48.86,36.2 | R601.1 48.74,35.47 48.74,34.45 50.2,32.99 C607.1
N$27
  pour Top: 5.56,47.94 2.7,47.94 2.7,54.29 5.56,54.29
N$28
  Top 0.254: U601.13 48.75,36.8 R601.2 47.66,34.87 L602.1 48.79,33.28 48.79,33.05 C606.1
N$29  (via drill 0.5)
  Top 0.254: v105.73,37.78 100.55,37.78 R403.1
  Bottom 0.254: MOD401.P$11 105.26,38.25 v105.73,37.78
N$30
  Top 0.203: C214.2 R211.1 20.8,48.79 20.8,46.67 21.87,45.6 IC201.P$12
N$31
  pour Top: 6.83,38.42 6.83,41.75 4.6,41.75 4.6,46.36 3.97,46.36 3.97,38.42
N$32
  Top 0.305: R404.1 Q402.3
N$33
  Bottom 0.305: IC801.5 43.17,7.15 44.29,6.03 76.8,6.03 SW805.P$1 | 78.61,4.23 SW805.P$1 | R811.2 78.66,4.13 SW805.P$1
N$34
  Top 0.254: R211.2 18.3,48.84 C215.2
N$35
  Top 0.203: IC201.P$8 23.47,49.98 23.81,50.32 L201.P$2
N$36
  Bottom 0.305: MOD401.P$10 102.31,37.55 101.76,38.1 101.76,42.44 C404.1 103.94,43.39 Q401.1
N$37
  Top 0.254: R216.1 C218.1
N$38
  Top 0.203: IC201.P$10 22.67,46.07 21.75,46.99 21.75,52.81 C206.2 | C206.2 19.74,53.18 R203.2 | C206.2 R202.1
N$39
  Top 0.203: IC201.P$11 22.27,45.84 21.27,46.83 21.27,51.75 21.11,51.91 19.47,51.91 18.68,51.12 C214.1
  Top 0.254: C215.1 R214.1 C218.2 | C215.1 18.26,50.54 C214.1 | R215.2 C215.1
N$40
  Bottom 0.305: MOD401.P$9 102.06,36.85 101.12,37.78 101.12,44.08 C403.1 102.82,45.78 Q401.2
N$41
  Top 0.203: 17.19,42.27 16.91,41.99 L205.P$1 | IC201.P$19 20.83,42.27 20.8,42.23
  Top 0.254: 20.8,42.23 17.15,42.23 16.91,41.99
N$42
  Top 0.203: 21.17,44.72 IC201.P$13 | 18.57,45.56 16.98,45.56 L205.P$2
  Top 0.254: 21.17,44.72 21.17,45.67 20.48,46.36 19.21,46.36 18.57,45.72 18.57,45.56
N$43  (via drill 0.5)
  Top 0.254: v111.6,31.59 108.74,34.45 108.74,39.37 109.7,40.32 109.7,43.5 108.11,45.09 JP401.2
  Top 0.305: R401.2 113.61,31.59 v111.6,31.59
  Bottom 0.305: MOD401.P$36 111.96,31.95 v111.6,31.59
N$44  (via drill 0.5)
  Top 0.254: v111.6,33.02 109.22,35.4 109.22,39.21 110.33,40.32 110.33,43.66 109.22,44.77 109.22,45.4 108.27,46.36 JP401.3
  Bottom 0.305: MOD401.P$35 111.97,32.65 v111.6,33.02
N$45
  Bottom 0.305: IC801.6 42.52,6.85 43.97,5.4 60.93,5.4 SW804.P$1 | 62.09,4.23 SW804.P$1 | R810.2 61.99,3.97 SW804.P$1
N$47
  Bottom 0.305: IC801.7 41.87,6.39 43.97,4.29 | 43.97,4.29 45.53,4.29 SW803.P$1 | R809.2 43.81,4.13 43.97,4.29
N$48  (via drill 0.5)
  Top 0.254: CN801.A7 10.41,8.8 v10.79,8.41
  Top 0.305: CN801.A7 12.93,8.8 13.49,9.37 R804.2
  Bottom 0.254: CN801.B7 8.01,9.45 9.05,8.41 v10.79,8.41
N$49
  Bottom 0.305: IC801.10 41.87,15.04 41.27,14.45 34.77,14.45 33.66,13.33 33.66,6.03 31.75,4.13 29.18,4.13 SW802.P$1 26.91,4.15 R808.2
N$50
  Bottom 0.254: IC801.9 41.22,15.66 40.64,15.08 19.21,15.08 17.14,13.02
  Bottom 0.305: 17.14,13.02 17.14,5.87 15.4,4.13 12.67,4.13 SW801.P$1 | SW801.P$1 12.62,4.13 | 12.33,4.47 SW801.P$1
  Bottom 0.406: R807.2 11.06,5.74 SW801.P$1
N$51
  Bottom 0.254: LED801.DOUT 71.52,10.71 70.17,12.06 67.62,12.06
  Bottom 0.305: 67.62,12.06 LED802.DIN
N$52
  Bottom 0.254: LED802.DOUT 55.01,10.71 53.66,12.06 51.12,12.06
  Bottom 0.305: 51.12,12.06 LED803.DIN
N$53
  Bottom 0.254: LED803.DOUT 48.19,10.71 46.51,12.38 43.97,12.38 43.66,12.06 34.6,12.06
  Bottom 0.305: 34.6,12.06 LED804.DIN
N$54
  Bottom 0.254: LED804.DOUT 21.83,10.71 20.48,12.06 18.09,12.06
  Bottom 0.305: 18.09,12.06 LED805.DIN
N$55
  Bottom 0.305: LED801.DIN 84.03,12.05 84.03,13.38 R812.1
N$56
  Bottom 0.305: IC801.4 43.82,7.45 44.61,6.67 87.51,6.67 SW806.D 89.47,6.39 R806.2
N$57
  Top 0.305: CN801.A5 10.28,9.8 10.48,10 10.48,13.07 R802.2
N$58
  Top 0.305: CN801.B5 7.08,8.25 6.51,8.25 5.71,7.46 5.71,4.29 6.77,3.23 R805.2
N$59
  cutout Route2: 120.33,27.78 110.33,27.78 110.33,28.89 108.11,28.89 108.11,27.78 98.74,27.78 arc90 96.2,25.24 96.2,21.43 120.33,21.43
  cutout Route15: 120.33,27.78 110.33,27.78 110.33,28.89 108.11,28.89 108.11,27.78 98.74,27.78 arc90 96.2,25.24 96.2,21.43 120.33,21.43
PROGRAM
  Top 0.254: IC601.10 56.99,34.01 56.99,33.81 58.9,31.91 63.5,31.91 64.14,32.54 64.14,36.83 64.16,36.8 CN701.P$1
PROGRAM'
  Top 0.254: JP701.P$20 57.76,14.47 56.36,15.88 18.79,15.88 R801.2
REG_MODE
  Top 0.203: IC201.P$9 23.07,46.31 22.23,47.15 22.23,56.67
  Top 0.254: 22.23,56.67 R210.2
RESET
  Top 0.254: U601.34 59.56,46.2 65.56,46.2 66.04,45.72 66.04,41.43 65.56,40.96 64.14,40.96 61.75,38.58 | IC601.4 59.53,37.26 59.53,37.31 60.64,38.42 61.59,38.42 61.75,38.58 | IC601.13 59.42,33.34 60.17,33.34 61.75,34.92 61.75,38.58
SCK  (via drill 0.5)
  Top 0.254: v114.62,36.2 113.19,37.62 113.19,45.09 112.55,45.72 112.55,57.47 111.76,58.26 v105.09,58.26 v69.37,58.26 v50.32,58.26 v36.67,58.26 | v50.48,51.59 50.16,51.28 50.16,50.45 U601.50
  Bottom 0.254: CN502.PAD4 115.62,35.2 v114.62,36.2 | CN505.PAD4 68.63,59.01 v69.37,58.26 | CN503.PAD4 104.19,59.17 v105.09,58.26 | v36.67,58.26 36.55,58.26 CN507.PAD4 | v50.48,51.59 50.48,58.1 v50.32,58.26
SCL  (via drill 0.5)
  Top 0.254: R602.1 59.06,47.81 U601.37 60.14,48.89 63.02,48.89 64.77,50.64 65.56,50.64 66.04,50.16 v67.31,50.16 67.79,50.16 68.26,50.64 104.46,50.64 104.78,50.96 v109.38,50.96 109.7,50.96 109.7,44.93 110.81,43.81 110.81,39.21 v110.49,38.89 | v68.1,43.02 68.28,42.84 IC501.14 | CN701.P$8 v71.16,38.85
  Bottom 0.254: v67.31,50.16 67.31,43.81 v68.1,43.02 71.16,39.97 v71.16,38.85 | v109.38,50.96 112.07,50.96 MOD402.P$3 | MOD401.P$26 110.55,38.95 v110.49,38.89
SCL1  (via drill 0.5)
  Top 0.203: R605.1 47.89,49.19 | 47.89,49.19
  Top 0.254: 47.89,49.19 U601.55 | v114.62,32.23 111.92,34.92 111.92,44.29 111.28,44.93 111.28,56.2 110.81,56.67 v109.06,56.67 v73.66,56.67 v46.51,56.67 v41.91,56.67 | R605.1 47.89,50.06 v46.51,51.44
  Bottom 0.254: CN502.PAD6 115.65,31.2 v114.62,32.23 | CN507.PAD6 36.88,61.71 v41.91,56.67 | CN505.PAD6 72.63,57.71 v73.66,56.67 | CN503.PAD6 108.19,57.55 v109.06,56.67 | v46.51,51.44 v46.51,56.67
SCL'  (via drill 0.5)
  Top 0.305: JP701.P$13 71.16,12.26 69.53,10.64 59.69,10.64 56.04,14.29 46.35,14.29 46.04,13.97 v44.77,13.97
  Bottom 0.305: v44.77,13.97 44.47,14.26 IC801.14
SDA  (via drill 0.5)
  Top 0.203: 59.92,50.42 59.92,50.64 R603.1 | 59.92,50.4 59.92,50.42 | 59.92,50.42 60,50.49 | 70.16,39.36 70.16,39.38 v70.01,39.53
  Top 0.254: U601.38 57.94,47.41 57.94,48.42 59.92,50.4 | 60,50.49 60.96,49.53 62.87,49.53 64.45,51.12 v66.36,51.12 103.82,51.12 105.09,52.39 v110.33,52.39 110.33,45.09 111.28,44.13 111.28,38.1 v111.12,37.94 | IC501.15 67.59,42.19 v67.47,42.07 | 70.16,39.36 CN701.P$7
  Bottom 0.254: v66.36,51.12 66.36,42.86 67.15,42.07 v67.47,42.07 v70.01,39.53 | MOD401.P$28 111.52,37.55 v111.12,37.94
  Bottom 0.406: MOD402.P$2 v110.33,52.39
SDA1  (via drill 0.5)
  Top 0.254: v114.62,34.13 112.55,36.2 112.55,44.77 111.92,45.4 111.92,56.83 111.28,57.47 v107.16,57.47 v71.6,57.47 v44.93,57.47 v39.37,57.47 | U601.56 45.24,51.13 | v45.24,51.28 45.24,51.13 | 45.24,51.13 43.36,51.13 R604.1
  Bottom 0.254: CN502.PAD5 115.55,33.2 v114.62,34.13 | CN505.PAD5 70.63,58.44 v71.6,57.47 | CN503.PAD5 106.19,58.44 v107.16,57.47 | CN507.PAD5 39.35,57.47 v39.37,57.47 | v44.93,57.47 45.24,57.15 v45.24,51.28
SDA'  (via drill 0.5)
  Top 0.305: JP701.P$14 70.16,12.22 69.22,11.27 60.01,11.27 56.36,14.92 v45.56,14.92
  Bottom 0.305: IC801.15 45.12,15.36 v45.56,14.92
SISO
  Top 0.254: U301.3 41.13,33.48 40.32,34.29 40.32,41.27 42.7,43.66 46.99,43.66 48.26,44.93 48.26,45.99 U601.59
SS_MOD0  (via drill 0.5)
  Top 0.254: IC501.4 76.37,43.49 76.83,43.02 105.25,43.02 105.41,42.86 v108.9,42.86
  Bottom 0.254: CN502.PAD1 114.25,42.86 v108.9,42.86
SS_MOD1  (via drill 0.5)
  Top 0.254: v97.63,44.93 97.5,44.79 87.97,44.79 87.79,44.61 86.84,44.61 86.68,44.77 75.65,44.77 IC501.6
  Bottom 0.254: CN503.PAD1 98.19,45.48 v97.63,44.93
SS_MOD2  (via drill 0.5)
  Top 0.254: IC501.9 69.48,46.09 69.48,46.94 v69.53,46.99
  Bottom 0.254: CN505.PAD1 62.71,61.86 62.71,61.44 69.53,54.61 v69.53,46.99
SS_MOD3  (via drill 0.5)
  Top 0.254: v70.8,55.09 41.59,55.09 40.64,56.04 38.89,56.04 38.1,56.83 36.04,56.83 35.08,57.78 33.18,57.78 32.54,58.42 30.16,58.42 29.53,59.05 v26.99,59.05 | IC501.11 70.51,44.79 v71.28,45.56
  Bottom 0.203: 26.88,59.32 26.88,59.17 v26.99,59.05
  Bottom 0.254: CN507.PAD1 26.88,59.32 | v71.28,45.56 71.28,54.61 v70.8,55.09
STB
  Top 0.254: U301.4 41.75,34.13 40.8,35.08 40.8,41.12 42.86,43.18 46.35,43.18 46.67,42.86 46.67,42.5 U601.2
USB+
  Top 0.254: U601.5 44.13,37.84 44.13,35.4 49.85,29.69 63.82,29.69 66.16,32.03 CN701.P$3
USB+'
  Top 0.254: R803.1 11.75,15.88 14.13,18.26 64.61,18.26 66.2,16.67 66.2,14.51 JP701.P$18
USB-
  Top 0.254: U601.6 44.61,37.6 44.61,35.72 50.16,30.16 63.5,30.16 65.16,31.82 CN701.P$2
USB-'
  Top 0.254: R804.1 13.49,16.83 14.45,17.78 64.29,17.78 65.25,16.83 65.25,14.56 JP701.P$19
USB_ID
  Top 0.254: IC601.6 57.47,36.71 57.47,37.49 U601.23
V+  (via drill 0.5)
  Top 0.203: IC201.P$24 23.47,40.19 v23.5,40.16 C204.1 | IC201.P$22 22.67,41.08 22.07,40.48 v21.75,40.48 21.75,39.53 C203.1 | 26.67,41.75 30,38.42 30.48,38.42 30.8,38.1 30.8,37.62 | 28.1,39.21 29.21,38.1 29.21,36.99 29.37,36.83 30.64,36.83 30.8,36.99 30.8,37.62 | Q202.2 30.84,37.58 30.8,37.62 | IC201.P$34 27.74,43.07 28.97,41.84 L202.P$3 | IC201.P$15 20.27,43.87 v19.84,44.29 | IC201.P$14 19.98,44.27
  Top 0.254: 19.98,44.27 19.95,44.29 v19.84,44.29
  Top 0.305: C211.1 v19.84,44.29
  Top 0.406: Q202.2 31.91,36.01 C208.1 33.15,34.77 v34.29,34.77 | L201.P$1 27.31,51.12 27.94,51.75 v29.05,51.75
  Route15 0.406: v29.05,51.75 29.53,51.75 30.48,50.8 v30.48,42.55 | v31.43,41.43 31.43,41.59 v30.48,42.55 | v30.48,42.55 28.26,40.32 23.65,40.32 v23.5,40.16 22.07,40.16 v21.75,40.48 | v34.29,34.77 32.23,34.77 30.48,36.51 v30.48,42.55 | v19.84,44.29 19.84,40.48 v21.75,40.48 | 21.91,40.48 v21.75,40.48
  pour Top (rank 2, no thermals): 27.78,43.18 27.78,40.48 32.23,40.48 32.23,43.18
VCC/2  (via drill 0.5)
  Top 0.203: C602.1 59.63,40.42 | 59.63,40.42
  Top 0.254: 27.78,37.15 27.94,37.15 29.53,35.56 | C602.1 59.12,40.79 U601.30 | R301.2 36.14,36.08 U301.8 37.31,36.09 v37.31,36.99 | v42.07,37.47 42.07,39.62 C605.1 C603.1 43.78,41.24 44.29,41.75 44.77,41.75 45.56,40.96 45.84,40.96 U601.3 47.11,42.23 47.47,42.23 48.42,41.27 48.42,40.71 U601.7 | L602.2 46.23,36.48 v45.56,37.15 | U601.48 53.43,50.31 C601.1 v51.91,53.18 | R602.2 57.86,49.6 v58.74,50.48 | R603.2 61.94,50.96 v63.02,50.96 | R605.2 45.57,48.41 v45.24,48.74 44.48,49.5 R604.2 | U301.1 42.86,31.91 v42.86,31.12 | IC601.1 60.64,36.24 C604.1 60.73,37.22 61.28,36.67 61.28,35.72 v60.8,35.24 | 59.63,40.42 v58.9,39.69 | IC501.16 70.91,41.54 v71.44,42.07
  Top 0.305: MOTOR401.- 9.44,36.82 D401.3 | CN701.P$17 80.16,35.55 v79.69,35.08 | CN701.P$16 79.16,35.62 v79.69,35.08 | v79.69,35.08 v79.69,33.81
  Bottom 0.203: 104.62,42.07 104.93,42.07 105.04,41.97
  Bottom 0.254: 105.04,40.4 105.04,41.97 | v104.46,42.23 104.62,42.07 C401.1 | v102.55,33.66 C402.1
  Bottom 0.305: MOD401.P$3 102.92,32.65 C402.1 | 105.04,40.4 MOD401.P$14
  Bottom 0.406: MOD402.P$1 111.53,56.77 v110.33,55.56
  other vias: 26.67,32.07 27.94,32.07
  pour Top (rank 2): 26.19,31.27 26.19,38.58 30.32,38.58 30.32,31.27
  pour Route15 (rank 2): 119.06,66.36 -0.64,66.04 -0.64,23.5 119.38,23.5
VCC/2'  (via drill 0.5)
  Top 0.305: v79.69,18.73 v79.69,17.3 | v79.69,17.3 80.16,16.84 JP701.P$4 | JP701.P$5 79.16,16.77 v79.69,17.3
  Bottom 0.254: v44.45,11.43 44.45,10.28 IC801.3 | LED801.VCC 85.28,10.71 C802.1 86.82,10.42 SW806.E
  Bottom 0.305: C803.1 68.71,10.71 | 68.71,10.71 LED802.VCC | C804.1 52.2,10.71 | 52.2,10.71 LED803.VCC | C805.1 35.69,10.71 | 35.69,10.71 LED804.VCC | C806.1 19.18,10.71 | 19.18,10.71 LED805.VCC | 87.61,11.21 SW806.E | 68.71,10.71 70.25,10.71 v70.96,10 70.96,8.76 SW804.P$4 SW805.P$3 | SW805.P$4 87.69,11.38 87.63,11.43 | 52.2,10.71 53.42,10.71 v54.13,10 54.13,9.05 54.26,8.92 54.29,8.92 SW803.P$4 | 19.18,10.71 20.25,10.71 21.64,9.31 SW801.P$4 | 20.95,9.05 21.15,9.05 SW801.P$4 | 35.69,10.71 36.91,10.71 v37.47,10.16 37.47,9.24 SW802.P$4 | SW801.P$4 21.67,8.57 v23.65,8.57 | v46.67,16.83 45.94,16.09 IC801.16
  Bottom 0.406: C801.1 SW806.E
  pour Route15: -1.11,19.84 99.22,19.84 99.06,-1.27 -1.27,-1.27
VDISPLAY
  Top 0.406: R303.2 17.94,36.83 16.99,37.78 10.16,37.78
  pour Top: 6.67,47.31 10.16,47.31 10.16,37.62 7.94,37.62 7.94,44.93 8.26,45.24 8.26,46.83 6.67,46.83
VIBES  (via drill 0.5)
  Top 0.254: U601.61 36.48,56.36 33.34,56.36 32.23,57.47 26.99,57.47 25.24,59.21 18.41,59.21 17.78,58.58 v11.43,58.58 | R405.2 2.75,35.03 v2.38,35.4
  Top 0.305: R405.2 3.98,35.02 Q402.1
  Bottom 0.254: v2.38,35.4 2.38,56.52 4.45,58.58 v11.43,58.58
VUSB
  Top 0.406: Q201.2 37.46,40.26 C201.1 38.26,40.16 39.21,39.21 39.21,33.34 43.66,28.89 64.77,28.89 68.16,32.28 68.16,34.29 | CN701.P$5 68.16,34.29 | CN701.P$4 67.16,35.29 68.16,34.29 | CN701.P$6 69.16,35.29 68.16,34.29
VUSB'  (via drill 0.5)
  Top 0.305: CN801.A9 7.83,7.8 CN801.B4 | CN801.A4 7.83,10.3 CN801.B9 | v15.4,19.21 v16.67,19.21 66.52,19.21 68.16,17.56 | JP701.P$16 68.16,17.56 | JP701.P$15 69.16,16.56 68.26,17.46 | 68.26,17.46 68.16,17.56 | JP701.P$17 67.16,16.36 68.26,17.46
  Bottom 0.305: v15.4,19.21 v16.67,19.21
  Bottom 0.406: CN801.B4 8.33,7.3 14.13,7.3 14.45,7.62 14.45,10.16 | CN801.B9 14.36,10.25 14.45,10.16 | 14.45,10.16 14.45,18.26 v15.4,19.21
WAKE_BLE  (via drill 0.5)
  Top 0.254: R403.2 98.27,37.47 95.25,40.48 67.47,40.48 65.72,38.73 v64.61,38.73 | U601.28 56.36,42.14 v56.36,42.55
  Bottom 0.254: v64.61,38.73 61.28,38.73 57.47,42.55 v56.36,42.55

## Text on the board
Dimension: CUT OUT | CUT OUT
tPlace: VOIDSTAR LAB | SINGULARITRON | PERSONAL AUGMENTATION PLATFORM | (C) Zack Freedman 2017 / Rev 1.0, last updated 7/31/2017 | PGM
bPlace: 1 | You feel... something. You are filled with detemmienation.